# EAGLE design GrblPiStepperDrivers (EAGLE 6.4)
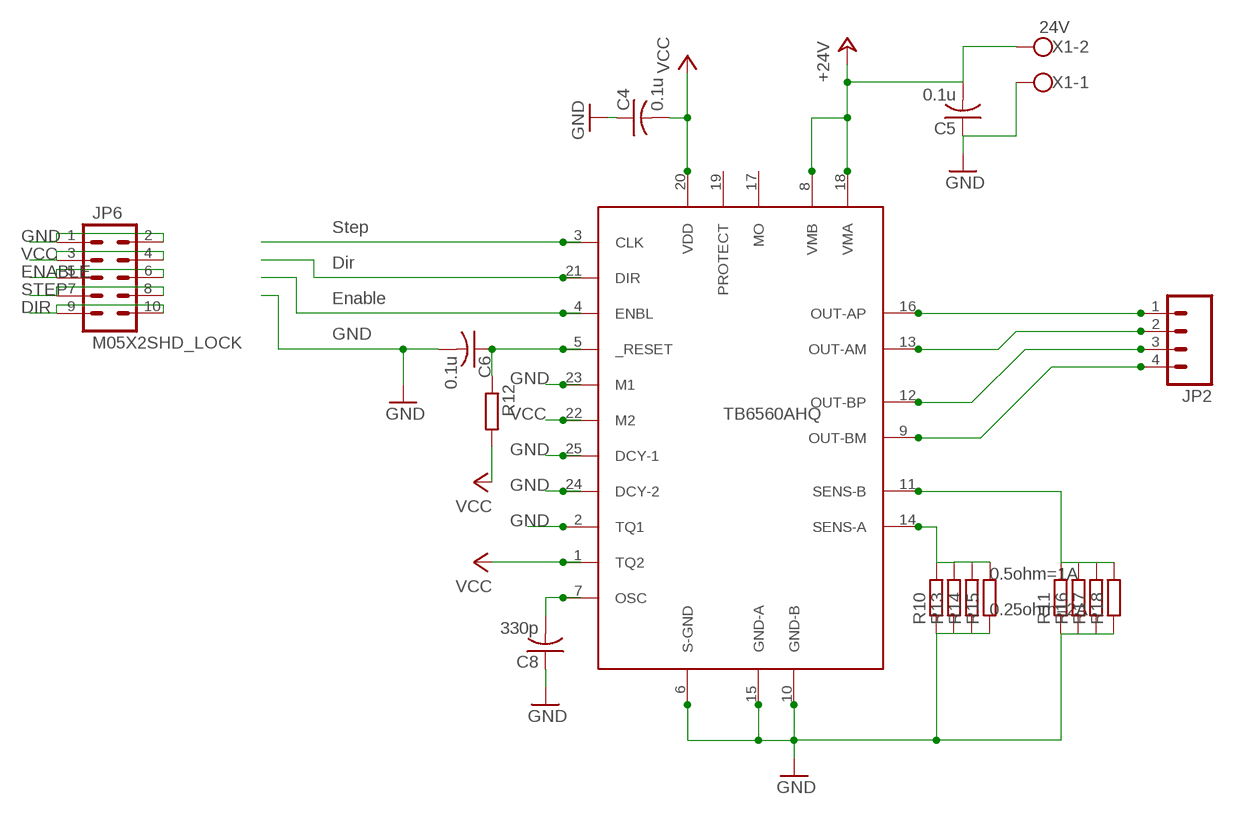
[diagram p0: schematic, sheet 1]

## Parts
C4  0.1u  C-USC1206K  [C1206K]
C5  0.1u  C-USC1206K  [C1206K]
C6  0.1u  C-USC1206K  [C1206K]
C8  330p  C-USC1206K  [C1206K]
JP2  M04SCREW  [SCREWTERMINAL-3.5MM-4]
JP6  M05X2SHD_LOCK  [2X5-SHROUDED_LOCK]
R10  R-EU_0411/3V  [0411V]
R11  R-EU_0411/3V  [0411V]
R12  R-EU_M1206  [M1206]
R13  R-EU_0411/3V  [0411V]
R14  R-EU_0411/3V  [0411V]
R15  R-EU_0411/3V  [0411V]
R16  R-EU_0411/3V  [0411V]
R17  R-EU_0411/3V  [0411V]
R18  R-EU_0411/3V  [0411V]
U$2  TB6560-H  [ZIP25-H]
X1  24V  W237-102  [W237-102]

## Nets
+24V: C5.2 U$2.8(VMB) U$2.18(VMA) X1.2
DIR: JP6.9 JP6.10 U$2.21(DIR)
ENABLE: JP6.5 JP6.6 U$2.4(ENBL)
GND: C4.1 C5.1 C6.2 C8.1 JP6.1 JP6.2 R10.1 R11.1 R13.1 R14.1 R15.1 R16.1 R17.1 R18.1 U$2.2(TQ1) U$2.6(S-GND) U$2.10(GND-B) U$2.15(GND-A) U$2.23(M1) U$2.24(DCY-2) U$2.25(DCY-1) X1.1
N$7: R10.2 R13.2 R14.2 R15.2 U$2.14(SENS-A)
N$8: R11.2 R16.2 R17.2 R18.2 U$2.11(SENS-B)
N$9: JP2.1 U$2.16(OUT-AP)
N$10: C8.2 U$2.7(OSC)
N$11: C6.1 R12.1 U$2.5(_RESET)
N$12: JP2.3 U$2.12(OUT-BP)
N$14: JP2.2 U$2.13(OUT-AM)
N$15: JP2.4 U$2.9(OUT-BM)
STEP: JP6.7 JP6.8 U$2.3(CLK)
VCC: C4.2 JP6.3 JP6.4 R12.2 U$2.1(TQ2) U$2.20(VDD) U$2.22(M2)
Unconnected: U$2.17(MO) U$2.19(PROTECT)

## Notes on the sheet
- Step
- Dir
- Enable
- GND
- TB6560AHQ
- 0.5ohm=1A
- 0.25ohm=2A

## Library data of the parts
C4-C6 C8 = adafruit:C-US: CAPACITOR, American symbol
JP2 = SparkFun-Connectors:M04: Header 4 Standard 4-pin 0.1" header. Use with straight break away headers (SKU : PRT-00116), right angle break away headers (PRT-00553), swiss pins (PRT-00743), machine pins (PRT-00117), and female headers (PRT-00115). Molex polarized connector foot print use with SKU : PRT-08231 with associated crimp pins and housings. 1MM SMD Version SKU: PRT-10208
JP6 = SparkFun-Connectors:M05X2: Header 5x2 Standard 10-pin dual row 0.1" header. Commonly used with AVR-ISP. Use with Spark Fun Electronics SKU: PRT-00778
R10 R11 R13-R18 = CNC-Components:R-EU_: RESISTOR, European symbol
R12 = rcl:R-EU_: RESISTOR, European symbol
U$2 = tb6560:TB6560-H
X1 = con-wago-500:W237-102: WAGO SCREW CLAMP; MPN: 237-102; OC_FARNELL: unknown; OC_NEWARK: 70K9898

## Net classes
0 default: clearance 0.635 mm

## Board
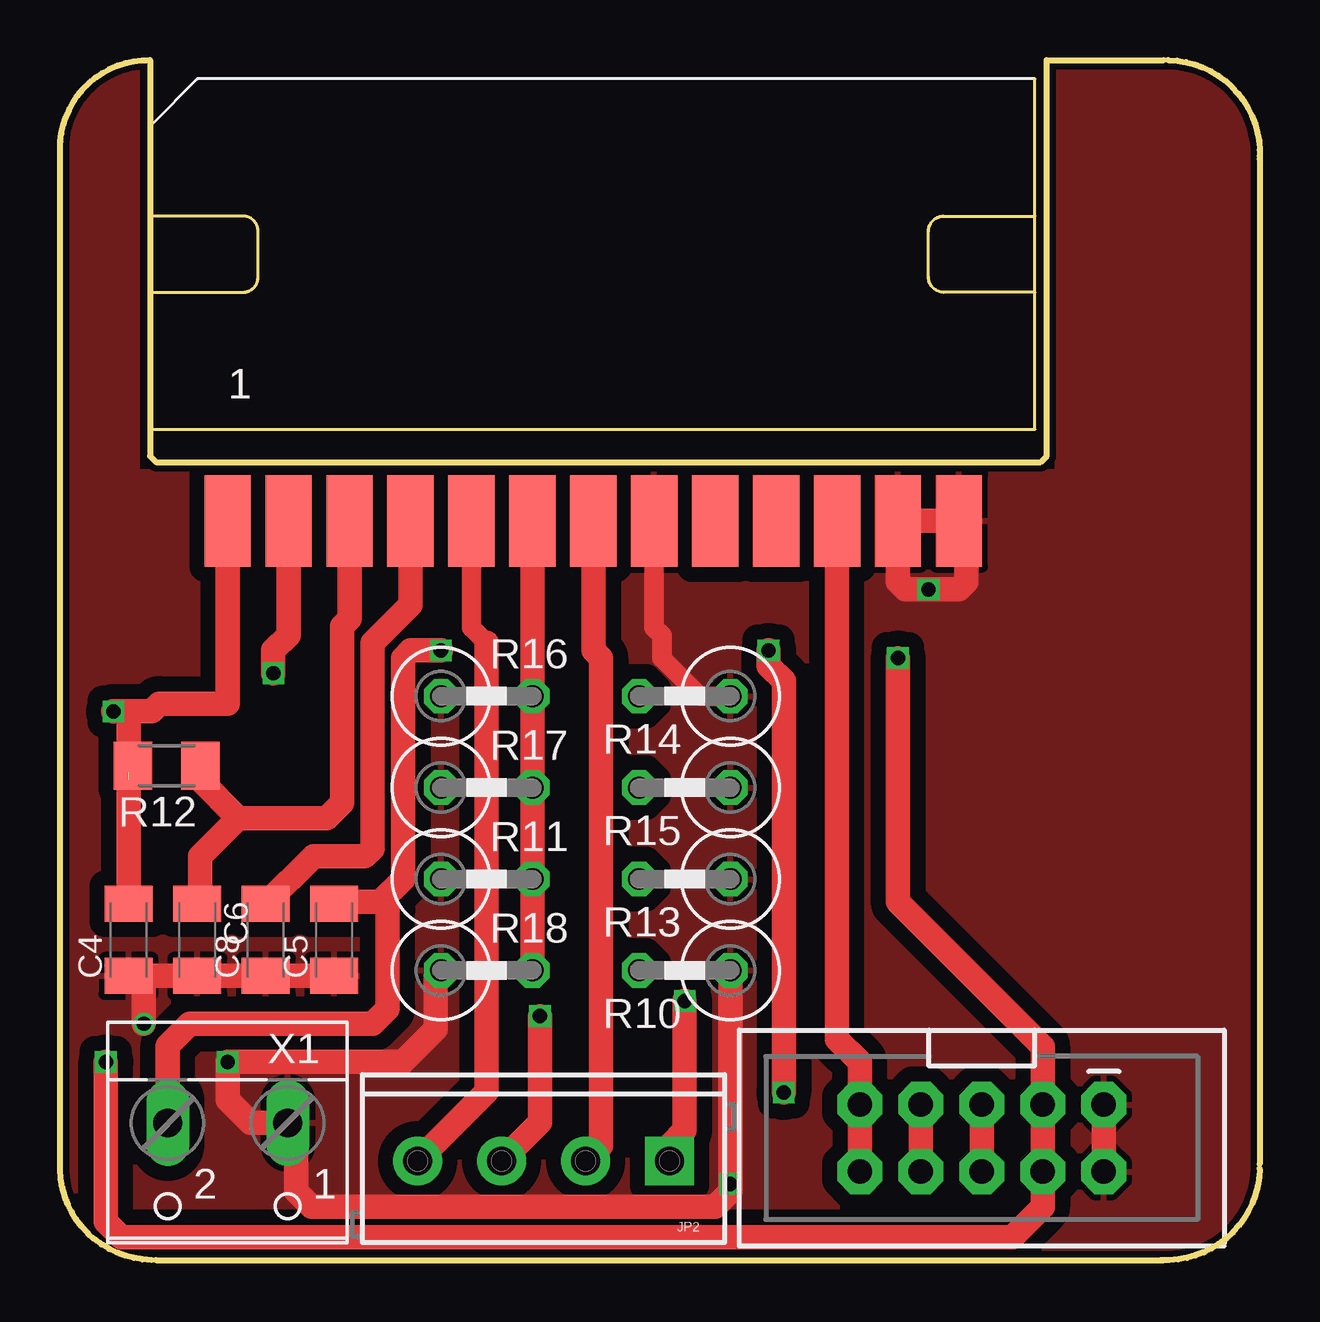
[diagram p1: board, top side]
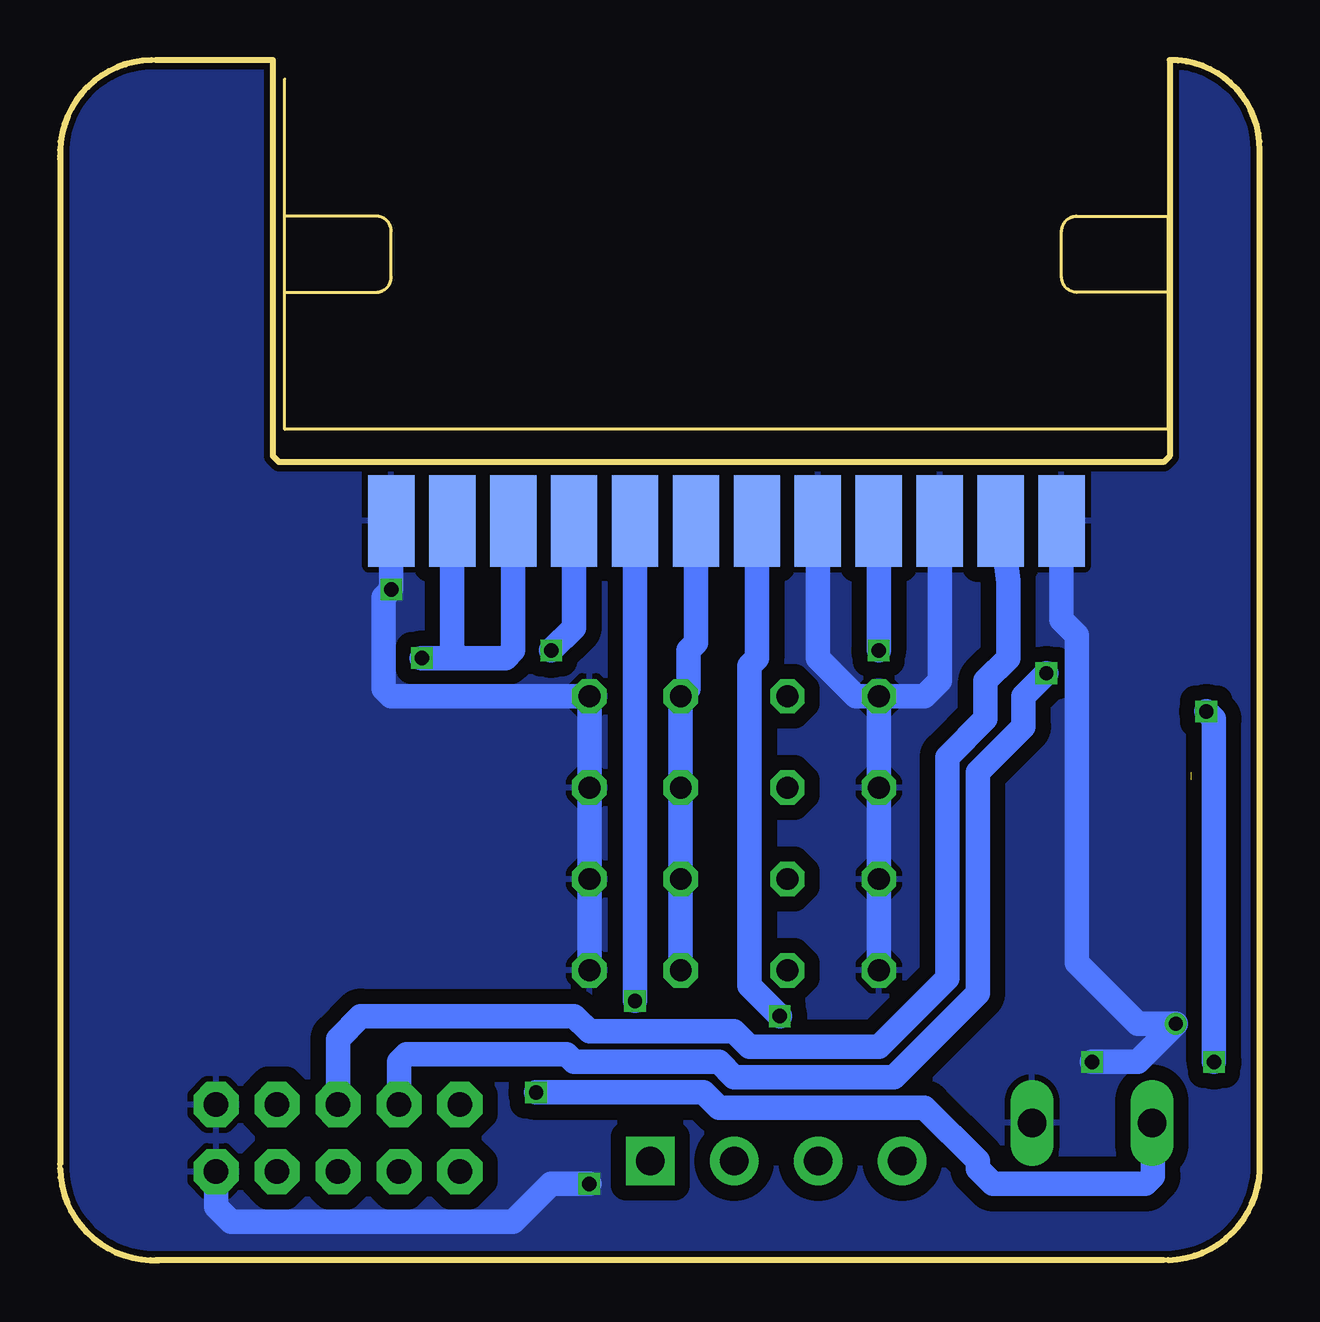
[diagram p2: board, bottom side, seen from below]

Size 50.01 x 50 mm. Coordinates in mm from the lower left corner, seen from the top.
Outline: 50,46 50,45.88
Outline: 50,45.88 50,4
Outline: 0,4 0,4.13
Outline: 0,4.13 0,46.19
Outline: 4,0 45.88,0
Outline: 45.88,0 46,0
Outline: 3.81,0 arc-92 0,4.13
Outline: 50,3.81 arc-92 45.88,0
Outline: 46,50 41.13,50 41.13,33.5 40.88,33.25 4,33.25 3.75,33.5 3.75,50 arc92 0,46.25
Outline: 46.19,50 arc-92 50,45.88
Copper layers (1*16): Top 0.035mm / dielectric 1.5mm / Bottom 0.035mm
Design rules "dirt_cheap_dirty_boards.v1": minimum track width 5mil, minimum drill 12mil, track to track 5mil, track to pad 5mil, pad to pad 5mil, via to via 5mil, smd to smd 0mil, copper to edge 10mil, drill to drill 10mil, minimum pad ring 10mil, minimum via ring 6mil, stop-mask expansion 2mil, vias tented up to drill 25mil, thermal gap 10mil

### Footprints (pad centres in the part's own frame; a part is rotated, then mirrored left to right if it is on the bottom)
C1206K = smd 1.5 x 2: 1 -1.5,0; 2 1.5,0
SCREWTERMINAL-3.5MM-4 = drill 1.2 pad 2.032 square: 1 0,0 | drill 1.2 pad 2.032: 2 3.5,0; 3 7,0; 4 10.5,0
2X5-SHROUDED_LOCK = drill 1.016 pad 1.88 octagon: 1 -1.397,5.08; 2 1.397,5.08; 3 -1.397,2.54; 4 1.397,2.54; 5 -1.397,0; 6 1.397,0; 7 -1.397,-2.54; 8 1.397,-2.54; 9 -1.397,-5.08; 10 1.397,-5.08
0411V = drill 0.914 octagon: 1 -2.54,0; 2 1.27,0
M1206 = smd 1.6 x 2: 1 -1.4,0; 2 1.4,0
ZIP25-H = smd 1.93 x 3.81: 1 2.54,-3.81; 3 5.08,-3.81; 5 7.62,-3.81; 7 10.16,-3.81; 9 12.7,-3.81; 11 15.24,-3.81; 13 17.78,-3.81; 15 20.32,-3.81; 17 22.86,-3.81; 19 25.4,-3.81; 21 27.94,-3.81; 23 30.48,-3.81; 25 33.02,-3.81 | smd 1.93 x 3.81 bottom: 2 3.81,-3.81; 4 6.35,-3.81; 6 8.89,-3.81; 8 11.43,-3.81; 10 13.97,-3.81; 12 16.51,-3.81; 14 19.05,-3.81; 16 21.59,-3.81; 18 24.13,-3.81; 20 26.67,-3.81; 22 29.21,-3.81; 24 31.75,-3.81
W237-102 = drill 1.194 long: 1 -2.5,-1.27; 2 2.5,-1.27

### Placement (x,y rotation side)
C4  2.86,13.34 90 top
C5  11.43,13.34 90 top
C6  5.72,13.34 270 top
C8  8.58,13.34 90 top
JP2  25.4,4.13 180 top
JP6  38.42,5.08 270 top
R10  25.4,12.07 180 top
R11  18.42,15.88 0 top
R12  4.45,20.59 180 top
R13  25.4,15.88 180 top
R14  25.4,23.5 180 top
R15  25.4,19.69 180 top
R16  18.42,23.5 0 top
R17  18.42,19.69 0 top
R18  18.42,12.07 0 top
U$2  4.45,34.61 0 top
X1  6.99,4.45 180 top

### Tracks (layer width: path | path; a pad name or v marks a point on that pad's centre or on a via)
+24V  (via drill 0.6)
  Top 1.016: 13.34,14.93 14.29,15.88 14.29,25.09 14.61,25.4 v15.88,25.4 | 13.34,14.93 11.52,14.93 C5.2 | X1.2 4.49,8.93 5.4,9.85 13.02,9.85 13.66,10.48 13.66,14.61 13.34,14.93 | v29.53,25.4 29.53,24.77 30.17,24.13 v30.17,6.99
  Bottom 1.016: U$2.18 28.58,26.36 v29.53,25.4 | v30.17,6.99 23.18,6.99 22.55,6.35 13.97,6.35 11.75,4.13 11.75,3.81 11.12,3.18 4.77,3.18 4.45,3.5 4.45,5.68 X1.2 | U$2.8 v15.88,25.4
DIR
  Top 1.016: JP6.10 JP6.9 33.34,8.26 32.39,9.21 U$2.21
ENABLE
  Top 1.016: JP6.5 JP6.6
  Bottom 1.016: JP6.5 38.42,9.21 37.47,10.16 28.58,10.16 27.94,9.53 21.91,9.53 21.28,8.89 15.88,8.89 13.02,11.75 13.02,20.96 11.43,22.55 11.43,24.13 10.48,25.09 10.48,28.26 U$2.4
GND  (via drill 0.6)
  Top 0.813: U$2.15 24.77,26.36 25.09,26.04 25.09,25.09 26.67,23.5 R14.1
  Top 1.016: C5.1 C8.1 C6.2 3.5,11.84 | 3.5,11.84 C4.1 | R18.1 15.65,11.84 15.65,9.62 14.29,8.26 v6.99,8.26 6.99,6.67 7.94,5.72 X1.1 9.85,5.36 9.85,2.86 10.48,2.23 27.31,2.23 27.94,2.86 v27.94,3.18 R10.1 | v3.5,9.85 3.5,11.84 | JP6.2 JP6.1 | U$2.23 U$2.25 37.79,30.48 37.79,28.26 37.47,27.94 v36.2,27.94 35.25,27.94 34.93,28.26 U$2.23
  Bottom 1.016: R16.1 R17.1 R11.1 R18.1 | R10.1 R13.1 R15.1 R14.1 36.2,23.5 36.52,23.82 36.52,27.63 v36.2,27.94 U$2.24 | R16.1 16.83,23.5 18.42,25.09 U$2.10 | v6.99,8.26 5.08,8.26 v3.5,9.85 5.08,9.85 7.62,12.39 7.62,26.04 8.26,26.67 U$2.2 | JP6.2 43.5,2.23 42.87,1.59 31.12,1.59 29.53,3.18 v27.94,3.18 | R16.1 13.97,23.5 13.34,24.13 U$2.6
  pour Top: 3.75,49.54 3.19,49.54 3.19,32.85 41.59,32.85 41.59,50.25 52.24,50.25 52.24,-1.72 -2.85,-1.72 -2.85,1.65 -2.81,1.65 -2.81,53.63 3.75,53.63
  pour Bottom: -1.42,51.19 51.3,51.19 51.3,-1.72 -2.73,-1.72 -2.73,50.48 -1.42,50.48
N$7
  Bottom 0.813: 23.82,23.82 R14.2
  Bottom 1.016: R14.2 R15.2 R13.2 R10.2 | U$2.14 23.5,25.72 23.82,25.4 23.82,23.82
N$8
  Top 1.016: U$2.11 R16.2 R17.2 R11.2 R18.2
N$9  (via drill 0.6)
  Top 1.016: v26.04,10.8 26.04,5.4 25.4,4.77 JP2.1
  Bottom 1.016: U$2.16 v26.04,10.8
N$10
  Top 1.016: U$2.7 14.61,27.31 13.02,25.72 13.02,17.15 12.7,16.83 10.57,16.83 C8.2
N$11
  Top 1.016: C6.1 5.85,14.97 5.85,16.83 7.44,18.42 | U$2.5 12.07,26.73 11.75,26.41 11.75,19.05 11.12,18.42 7.44,18.42 | R12.1 5.85,20.01 7.44,18.42
N$12  (via drill 0.6)
  Top 1.016: v20.01,10.16 20.01,5.73 JP2.3
  Bottom 1.016: U$2.12 20.96,25.09 21.28,24.77 21.28,11.43 v20.01,10.16
N$14
  Top 1.016: U$2.13 22.23,25.4 22.55,25.09 22.55,4.77 JP2.2
N$15
  Top 0.813: U$2.9 17.15,26.36 17.78,25.72
  Top 1.016: 17.78,25.72 17.78,7.01 JP2.4
STEP  (via drill 0.6)
  Top 1.016: v8.89,24.45 8.89,25.4 9.53,26.04 U$2.3 | JP6.7 JP6.8
  Bottom 1.016: JP6.7 35.88,8.26 35.56,8.58 28.9,8.58 28.58,8.26 22.55,8.26 21.91,7.62 15.24,7.62 11.75,11.12 11.75,20.32 9.85,22.23 9.85,23.5 v8.89,24.45
VCC  (via drill 0.6)  (1 unrouted)
  Top 1.016: C4.2 2.86,20.33 | 2.86,20.33 2.86,20.48 R12.2 2.86,20.33 | U$2.1 6.99,23.18 4.13,23.18 3.81,22.86 2.86,22.86 | 2.86,22.86 2.86,20.01 | JP6.4 JP6.3 | JP6.3 40.96,2.23 39.69,0.96 2.54,0.96 1.91,1.59 v1.91,8.26 | v2.23,22.86 2.86,22.86 | v34.93,25.09 34.93,14.93 40.96,8.89 JP6.3
  Bottom 1.016: U$2.22 33.66,25.4 33.34,25.09 | 33.34,25.09 31.44,25.09 31.12,25.4 U$2.20 | v1.91,8.26 1.91,22.55 v2.23,22.86 | 33.34,25.09 v34.93,25.09

### Text on the board
OPENHWSILK: OpenHardware.co.za | TB6560 | 10K | Stepper | Driver | 104 | 104 | 104 | 330P | GrblPI Cable | DIR | STEP | ENABLE | VCC | GND | 24v | STEPPER MOTOR | +